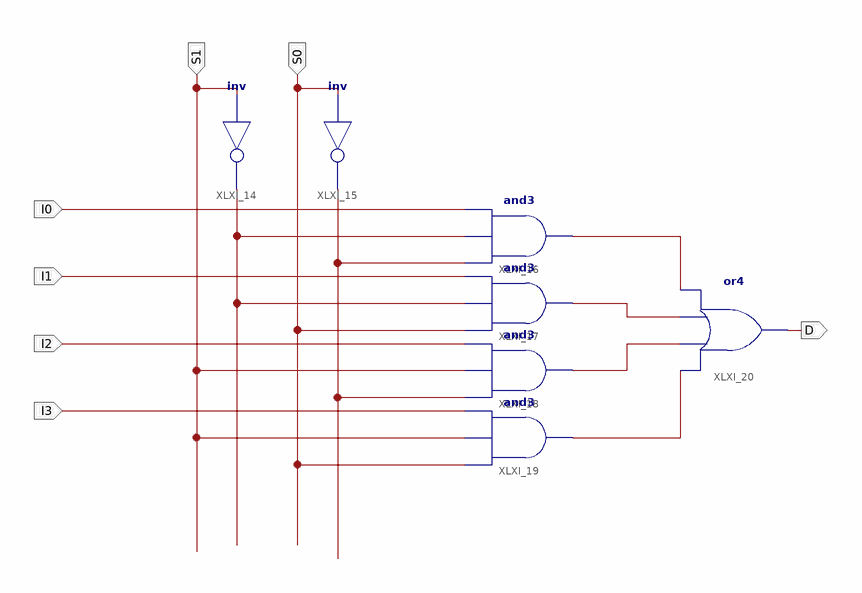
[diagram p0: schematic sheet 1]
// Xilinx ISE schematic four_input_mux.sch (spartan3e) as structural Verilog: 7 symbols, 7 ports
module four_input_mux (
  input  I0,
  input  I1,
  input  I2,
  input  I3,
  input  S1,
  input  S0,
  output D
);

  wire XLXN_21, XLXN_22, XLXN_23, XLXN_24, XLXN_25, XLXN_26;

  not XLXI_14 (XLXN_22, S1);
  not XLXI_15 (XLXN_21, S0);
  and XLXI_16 (XLXN_23, XLXN_21, XLXN_22, I0);
  and XLXI_17 (XLXN_24, S0, XLXN_22, I1);
  and XLXI_18 (XLXN_25, XLXN_21, S1, I2);
  and XLXI_19 (XLXN_26, S0, S1, I3);
  or XLXI_20 (D, XLXN_26, XLXN_25, XLXN_24, XLXN_23);
endmodule
